# EAGLE schematic mainboard (EAGLE 5.07)
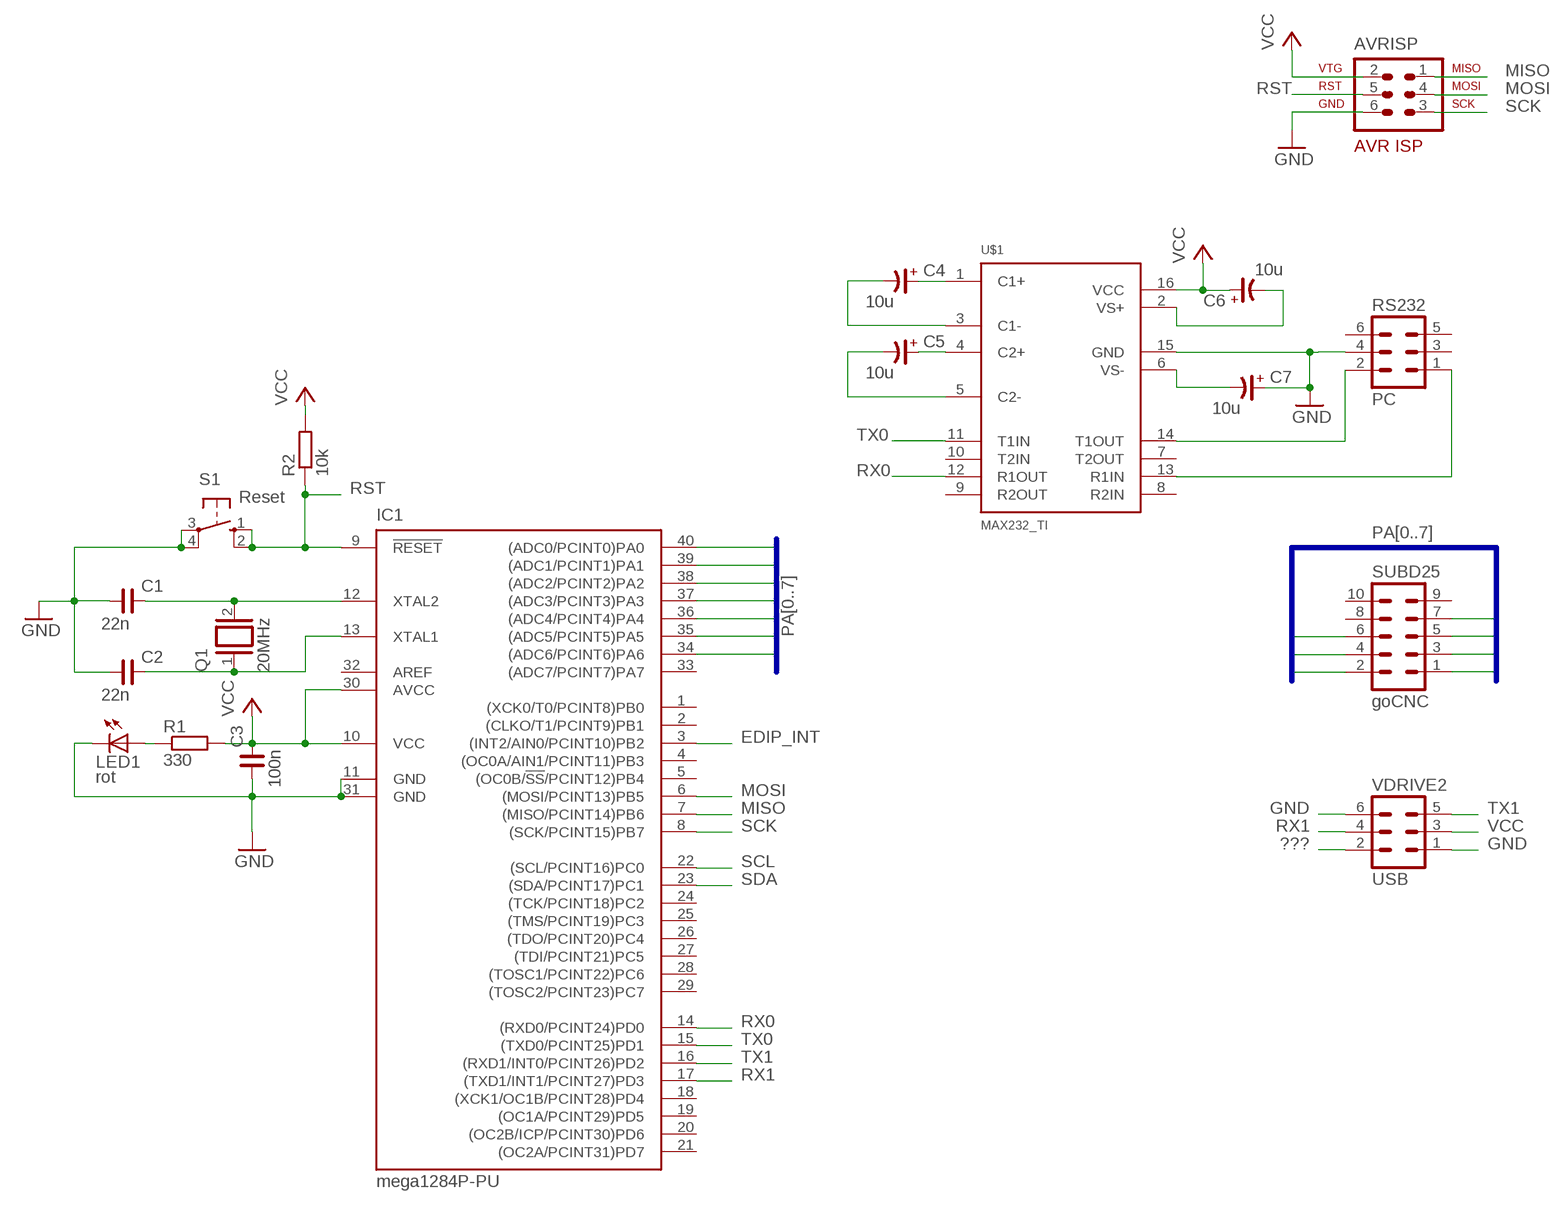
[diagram p0: schematic, sheet 1]

## Parts
AVRISP  AVR-ISP-6  [AVR-ISP-6]
C1  22n  C_C025-050X025  [C025-050X025]
C2  22n  C_C025-050X025  [C025-050X025]
C3  100n  C_C025-050X025  [C025-050X025]
C4  10u  CP_TT025-050  [CTT-025-050]
C5  10u  CP_TT025-050  [CTT-025-050]
C6  10u  CP_TT025-050  [CTT-025-050]
C7  10u  CP_TT025-050  [CTT-025-050]
IC1  mega1284P-PU  MEGA164P/324P/644P-PU  [DIL40]
LED1  rot  LED3MM  [LED3MM]
Q1  20MHz  XTAL/S  [QS]
R1  330  R-EU_0207/10  [0207/10]
R2  10k  R-EU_0207/10  [0207/10]
RS232  PC  ML6  [ML6]
S1  Reset  10-XX  [B3F-10XX]
SUBD25  goCNC  ML10  [ML10]
U$1  MAX232_TI  [DIL16]
VDRIVE2  USB  ML6  [ML6]

## Nets
???: VDRIVE2.2
EDIP_INT: IC1.3((INT2/AIN0/PCINT10)PB2)
GND: AVRISP.6 C1.1 C2.1 C3.1 C7.+ IC1.11(GND) IC1.31(GND) LED1.K(C) RS232.4 S1.3(P) S1.4(P1) U$1.15(GND) VDRIVE2.1 VDRIVE2.6
MISO: AVRISP.1 IC1.7((MISO/PCINT14)PB6)
MOSI: AVRISP.4 IC1.6((MOSI/PCINT13)PB5)
N$1: C1.2 IC1.12(XTAL2) Q1.2
N$2: C4.+ U$1.1(C1+)
N$3: LED1.A R1.1
N$4: C4.- U$1.3(C1-)
N$5: C2.2 IC1.13(XTAL1) Q1.1
N$6: C5.+ U$1.4(C2+)
N$7: C5.- U$1.5(C2-)
N$8: C6.- U$1.2(VS+)
N$10: RS232.2 U$1.14(T1OUT)
N$11: RS232.1 U$1.13(R1IN)
N$12: C7.- U$1.6(VS-)
PA0: IC1.40((ADC0/PCINT0)PA0) SUBD25.1
PA1: IC1.39((ADC1/PCINT1)PA1) SUBD25.2
PA2: IC1.38((ADC2/PCINT2)PA2) SUBD25.3
PA3: IC1.37((ADC3/PCINT3)PA3) SUBD25.4
PA4: IC1.36((ADC4/PCINT4)PA4) SUBD25.5
PA5: IC1.35((ADC5/PCINT5)PA5) SUBD25.6
PA6: IC1.34((ADC6/PCINT6)PA6) SUBD25.7
RST: AVRISP.5 IC1.9(!RESET) R2.1 S1.1(S) S1.2(S1)
RX0: IC1.14((RXD0/PCINT24)PD0) U$1.12(R1OUT)
RX1: IC1.17((TXD1/INT1/PCINT27)PD3) VDRIVE2.4
SCK: AVRISP.3 IC1.8((SCK/PCINT15)PB7)
SCL: IC1.22((SCL/PCINT16)PC0)
SDA: IC1.23((SDA/PCINT17)PC1)
TX0: IC1.15((TXD0/PCINT25)PD1) U$1.11(T1IN)
TX1: IC1.16((RXD1/INT0/PCINT26)PD2) VDRIVE2.5
VCC: AVRISP.2 C3.2 C6.+ IC1.10(VCC) IC1.30(AVCC) R1.2 R2.2 U$1.16(VCC) VDRIVE2.3
Unconnected: IC1.1((XCK0/T0/PCINT8)PB0) IC1.2((CLKO/T1/PCINT9)PB1) IC1.4((OC0A/AIN1/PCINT11)PB3) IC1.5((OC0B/!SS!/PCINT12)PB4) IC1.18((XCK1/OC1B/PCINT28)PD4) IC1.19((OC1A/PCINT29)PD5) IC1.20((OC2B/ICP/PCINT30)PD6) IC1.21((OC2A/PCINT31)PD7) IC1.24((TCK/PCINT18)PC2) IC1.25((TMS/PCINT19)PC3) IC1.26((TDO/PCINT20)PC4) IC1.27((TDI/PCINT21)PC5) IC1.28((TOSC1/PCINT22)PC6) IC1.29((TOSC2/PCINT23)PC7) IC1.33((ADC7/PCINT7)PA7) RS232.3 RS232.5 RS232.6 SUBD25.8 SUBD25.9 SUBD25.10 U$1.7(T2OUT) U$1.8(R2IN) U$1.9(R2OUT) U$1.10(T2IN)

## Buses
PA[0..7]

## Power pins joined to a net without a drawn wire
AREF: IC1.32(AREF)

## Library data of the parts
AVRISP = avr-6:AVR-ISP-6: AVR ISP-6 Serial Programming Header
C1-C3 = rc-master:C_: NON-POLARIZED CAP
C4-C7 = rc-master:CP_: POLARIZED CAP
IC1 = avr-5:MEGA164P/324P/644P-PU
LED1 = led:LED: LED OSRAM: - CHIPLED LG R971, LG N971, LY N971, LG Q971, LY Q971, LO R971, LY R971 LH N974, LH R974 LS Q976, LO Q976, LY Q976 LO Q996 - Hyper CHIPLED LW Q18S LB Q993, LB Q99A, LB R99A - SideLED LS A670, LO A670, LY A670, LG A670, LP A670 LB A673, LV A673, LT A673, LW A673 LH A674 LY A675 LS A676, LA A676, LO A676, LY A676, LW A676 LS A679, LY A679, LG A679 - Hyper Micro SIDELED® LS Y876, LA Y876, LO Y876, LY Y876 LT Y87S - SmartLED LW L88C, LW L88S LB L89C, LB L89S, LG L890 LS L89K, LO L89K, LY L89K LS L896, LA L896, LO L896, LY L896 - TOPLED LS T670, LO T670, LY T670, LG T670, LP T670 LSG T670, LSP T670, LSY T670, LOP T670, LYG T670 LG T671, LOG T671, LSG T671 LB T673, LV T673, LT T673, LW T673 LH T674 LS T676, LA T676, LO T676, LY T676, LB T676, LH T676, LSB T676, LW T676 LB T67C, LV T67C, LT T67C, LS T67K, LO T67K, LY T67K, LW E67C LS E67B, LA E67B, LO E67B, LY E67B, LB E67C, LV E67C, LT E67C LW T67C LS T679, LY T679, LG T679 LS T770, LO T770, LY T770, LG T770, LP T770 LB T773, LV T773, LT T773, LW T773 LH T774 LS E675, LA E675, LY E675, LS T675 LS T776, LA T776, LO T776, LY T776, LB T776 LHGB T686 LT T68C, LB T68C - Hyper Mini TOPLED® LB M676 - Mini TOPLED Santana® LG M470 LS M47K, LO M47K, LY M47K Source: http://www.osram.convergy.de LUXEON: - LUMILED® LXK2-PW12-R00, LXK2-PW12-S00, LXK2-PW14-U00, LXK2-PW14-V00 LXK2-PM12-R00, LXK2-PM12-S00, LXK2-PM14-U00 LXK2-PE12-Q00, LXK2-PE12-R00, LXK2-PE12-S00, LXK2-PE14-T00, LXK2-PE14-U00 LXK2-PB12-K00, LXK2-PB12-L00, LXK2-PB12-M00, LXK2-PB14-N00, LXK2-PB14-P00, LXK2-PB14-Q00 LXK2-PR12-L00, LXK2-PR12-M00, LXK2-PR14-Q00, LXK2-PR14-R00 LXK2-PD12-Q00, LXK2-PD12-R00, LXK2-PD12-S00 LXK2-PH12-R00, LXK2-PH12-S00 LXK2-PL12-P00, LXK2-PL12-Q00, LXK2-PL12-R00 Source: www.luxeon.com KINGBRIGHT: KA-3528ASYC Source: www.kingbright.com
Q1 = special:XTAL/S: CRYSTAL
R1 R2 = resistor:R-EU_: RESISTOR, European symbol
RS232 VDRIVE2 = con-harting-ml:ML6: HARTING
S1 = switch-omron:10-XX: OMRON SWITCH
SUBD25 = con-harting-ml:ML10: HARTING
U$1 = max232ti:MAX232_TI: MAX232, Texas Instruments Version